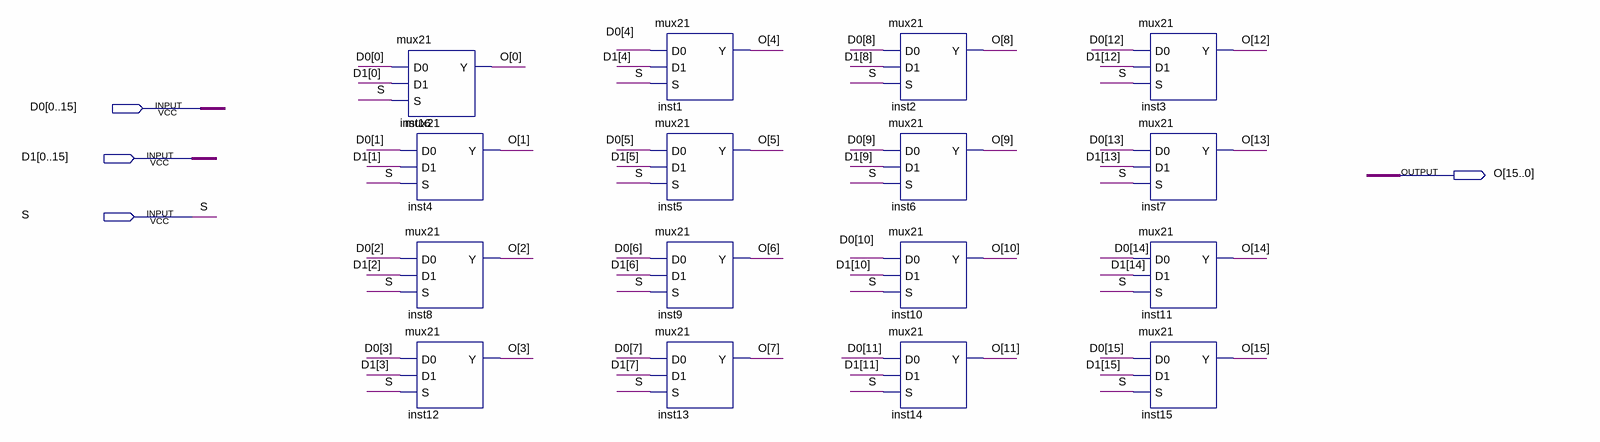
[diagram p0: schematic sheet]
// Quartus schematic mux2_16bit.bdf as structural Verilog: 16 symbols, 4 pins
module mux2_16bit (
  input  [0:15] D0,
  input  [0:15] D1,
  input  S,
  output [15:0] O
);

  mux21 inst16 (.D0(D0[0]), .D1(D1[0]), .S(S), .Y(O[0]));
  mux21 inst4 (.D0(D0[1]), .D1(D1[1]), .S(S), .Y(O[1]));
  mux21 inst8 (.D0(D0[2]), .D1(D1[2]), .S(S), .Y(O[2]));
  mux21 inst12 (.D0(D0[3]), .D1(D1[3]), .S(S), .Y(O[3]));
  mux21 inst1 (.D0(D0[4]), .D1(D1[4]), .S(S), .Y(O[4]));
  mux21 inst5 (.D0(D0[5]), .D1(D1[5]), .S(S), .Y(O[5]));
  mux21 inst9 (.D0(D0[6]), .D1(D1[6]), .S(S), .Y(O[6]));
  mux21 inst13 (.D0(D0[7]), .D1(D1[7]), .S(S), .Y(O[7]));
  mux21 inst2 (.D0(D0[8]), .D1(D1[8]), .S(S), .Y(O[8]));
  mux21 inst6 (.D0(D0[9]), .D1(D1[9]), .S(S), .Y(O[9]));
  mux21 inst10 (.D0(D0[10]), .D1(D1[10]), .S(S), .Y(O[10]));
  mux21 inst14 (.D0(D0[11]), .D1(D1[11]), .S(S), .Y(O[11]));
  mux21 inst3 (.D0(D0[12]), .D1(D1[12]), .S(S), .Y(O[12]));
  mux21 inst7 (.D0(D0[13]), .D1(D1[13]), .S(S), .Y(O[13]));
  mux21 inst11 (.D0(D0[14]), .D1(D1[14]), .S(S), .Y(O[14]));
  mux21 inst15 (.D0(D0[15]), .D1(D1[15]), .S(S), .Y(O[15]));
endmodule
